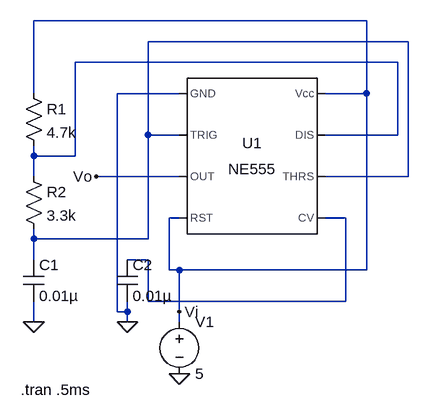
[diagram p0: schematic astable555.asc]
astable555.asc, the LTspice schematic file:
Version 4
SHEET 1 880 680
WIRE 400 -48 -112 -48
WIRE 464 -16 64 -16
WIRE 448 16 -48 16
WIRE -112 64 -112 -48
WIRE 112 64 16 64
WIRE 400 64 400 -48
WIRE 400 64 336 64
WIRE 64 128 64 -16
WIRE 112 128 64 128
WIRE 448 128 448 16
WIRE 448 128 336 128
WIRE -112 160 -112 144
WIRE -48 160 -48 16
WIRE -48 160 -112 160
WIRE -112 192 -112 160
WIRE 112 192 -16 192
WIRE 464 192 464 -16
WIRE 464 192 336 192
WIRE 112 256 96 256
WIRE 368 256 336 256
WIRE -112 288 -112 272
WIRE 64 288 64 128
WIRE 64 288 -112 288
WIRE -112 320 -112 288
WIRE 64 320 32 320
WIRE 96 336 96 256
WIRE 112 336 96 336
WIRE 400 336 400 64
WIRE 400 336 112 336
WIRE 64 384 64 320
WIRE 368 384 368 256
WIRE 368 384 64 384
WIRE 16 400 16 64
WIRE 32 400 32 384
WIRE 32 400 16 400
WIRE 112 400 112 336
WIRE -112 416 -112 384
WIRE 32 416 32 400
WIRE 112 416 112 400
FLAG 32 416 0
FLAG -112 416 0
FLAG 112 496 0
FLAG 112 400 Vi
FLAG -16 192 Vo
SYMBOL Misc\\NE555 224 160 R0
SYMATTR InstName U1
SYMBOL res -128 48 R0
SYMATTR InstName R1
SYMATTR Value 4.7k
SYMBOL res -128 176 R0
SYMATTR InstName R2
SYMATTR Value 3.3k
SYMBOL cap -128 320 R0
SYMATTR InstName C1
SYMATTR Value 0.01µ
SYMBOL cap 16 320 R0
SYMATTR InstName C2
SYMATTR Value 0.01µ
SYMBOL voltage 112 400 R0
WINDOW 123 0 0 Left 0
WINDOW 39 0 0 Left 0
SYMATTR InstName V1
SYMATTR Value 5
TEXT -132 520 Left 2 !.tran .5ms

The netlist it stands for:
* astable555.asc
XU1 0 N001 Vo Vi N003 N001 N002 Vi NE555  ; pins GND TRIG OUT RST CV THRS DIS Vcc
R1 Vi N002 4.7k
R2 N002 N001 3.3k
C1 N001 0 0.01µ
C2 N003 0 0.01µ
V1 Vi 0 5
.tran .5ms
.lib NE555.sub
.backanno
.end